# EAGLE schematic trill-bar (EAGLE 6.5.0)
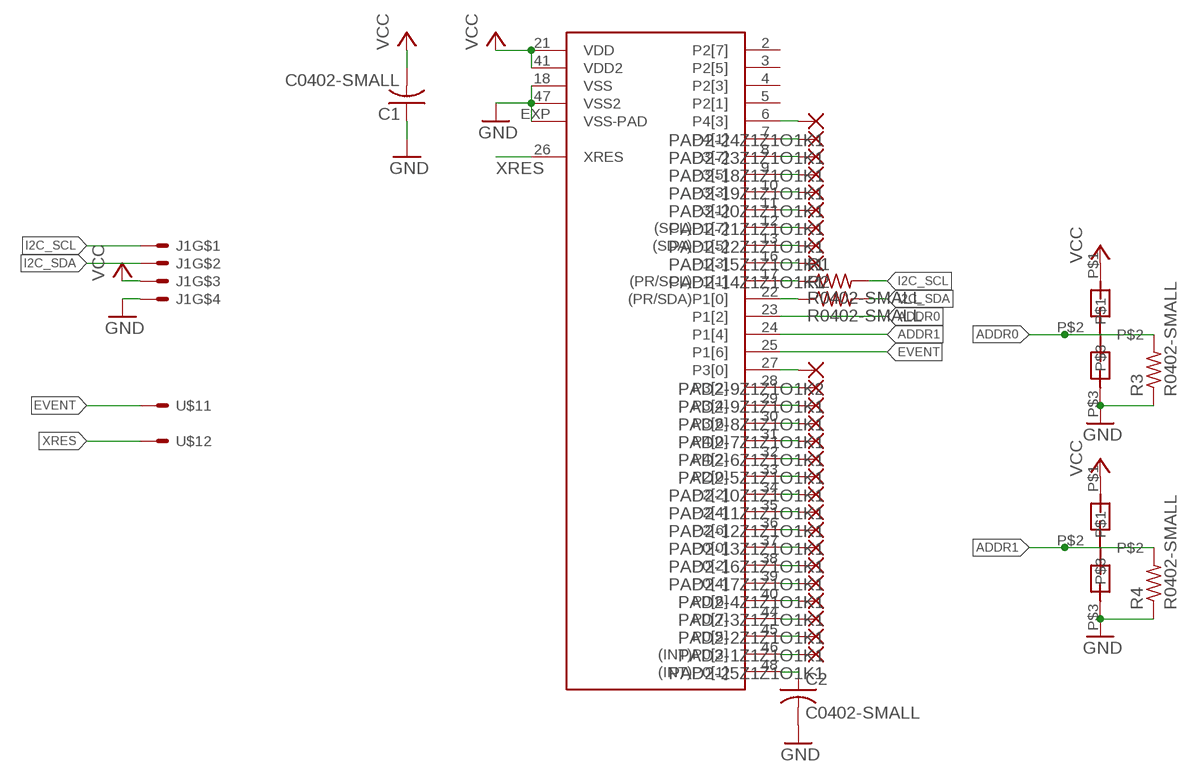
[diagram p0: schematic, sheet 1]

## Parts
C1  C0402-SMALL  [C0402-SMALL]
C2  C0402-SMALL  [C0402-SMALL]
IC1  CY8C206X6A  [QFN48-LEADS]
J1  GROVE-SMT  [JST-PH-4-SMT]
PAD2-1Z1Z1O1K1  SMD2  [SMD1,27-2,54]
PAD2-2Z1Z1O1K1  SMD2  [SMD1,27-2,54]
PAD2-3Z1Z1O1K1  SMD2  [SMD1,27-2,54]
PAD2-4Z1Z1O1K1  SMD2  [SMD1,27-2,54]
PAD2-5Z1Z1O1K1  SMD2  [SMD1,27-2,54]
PAD2-6Z1Z1O1K1  SMD2  [SMD1,27-2,54]
PAD2-7Z1Z1O1K1  SMD2  [SMD1,27-2,54]
PAD2-8Z1Z1O1K1  SMD2  [SMD1,27-2,54]
PAD2-9Z1Z1O1K1  SMD2  [SMD1,27-2,54]
PAD2-9Z1Z1O1K2  SMD2  [SMD1,27-2,54]
PAD2-10Z1Z1O1K1  SMD2  [SMD1,27-2,54]
PAD2-11Z1Z1O1K1  SMD2  [SMD1,27-2,54]
PAD2-12Z1Z1O1K1  SMD2  [SMD1,27-2,54]
PAD2-13Z1Z1O1K1  SMD2  [SMD1,27-2,54]
PAD2-14Z1Z1O1K1  SMD2  [SMD1,27-2,54]
PAD2-15Z1Z1O1K1  SMD2  [SMD1,27-2,54]
PAD2-16Z1Z1O1K1  SMD2  [SMD1,27-2,54]
PAD2-17Z1Z1O1K1  SMD2  [SMD1,27-2,54]
PAD2-18Z1Z1O1K1  SMD2  [SMD1,27-2,54]
PAD2-19Z1Z1O1K1  SMD2  [SMD1,27-2,54]
PAD2-20Z1Z1O1K1  SMD2  [SMD1,27-2,54]
PAD2-21Z1Z1O1K1  SMD2  [SMD1,27-2,54]
PAD2-22Z1Z1O1K1  SMD2  [SMD1,27-2,54]
PAD2-23Z1Z1O1K1  SMD2  [SMD1,27-2,54]
PAD2-24Z1Z1O1K1  SMD2  [SMD1,27-2,54]
PAD2-25Z1Z1O1K1  SMD2  [SMD1,27-2,54]
R1  R0402-SMALL  [C0402-SMALL]
R2  R0402-SMALL  [C0402-SMALL]
R3  R0402-SMALL  [C0402-SMALL]
R4  R0402-SMALL  [C0402-SMALL]
U$7  SOLDER_JUMPER_3PAD  [SOLDER_JUMPER_3PAD]
U$8  SOLDER_JUMPER_3PAD  [SOLDER_JUMPER_3PAD]
U$11  JST-SMT-EXTRAPAD  [JST-SMT-EXTRAPAD]
U$12  JST-SMT-EXTRAPAD  [JST-SMT-EXTRAPAD]

## Nets
ADDR0: IC1.23(P1[2]) R3.P$2 U$7.P$2
ADDR1: IC1.24(P1[4]) R4.P$2 U$8.P$2
EVENT: IC1.25(P1[6]) U$11.P$1(S)
GND: C1.P$1 C2.P$2 IC1.18(VSS) IC1.47(VSS2) IC1.EXP(VSS-PAD) J1.4 R3.P$1 R4.P$1 U$7.P$3 U$8.P$3
I2C_SCL: J1.1 R1.P$2
I2C_SDA: J1.2 R2.P$2
N$3: C2.P$1 IC1.48((INT)P0[1])
N$71Z1Z1O1K1: IC1.17((PR/SCL)P1[1]) R1.P$1
N$72Z1Z1O1K1: IC1.22((PR/SDA)P1[0]) R2.P$1
SENS1: IC1.27(P3[0]) PAD2-9Z1Z1O1K2.1(P)
SENS2: IC1.28(P3[2]) PAD2-9Z1Z1O1K1.1(P)
SENS3: IC1.29(P3[4]) PAD2-8Z1Z1O1K1.1(P)
SENS4: IC1.30(P3[6]) PAD2-7Z1Z1O1K1.1(P)
SENS5: IC1.31(P4[0]) PAD2-6Z1Z1O1K1.1(P)
SENS6: IC1.32(P4[2]) PAD2-5Z1Z1O1K1.1(P)
SENS7: IC1.33(P2[0]) PAD2-10Z1Z1O1K1.1(P)
SENS8: IC1.34(P2[2]) PAD2-11Z1Z1O1K1.1(P)
SENS9: IC1.35(P2[4]) PAD2-12Z1Z1O1K1.1(P)
SENS10: IC1.36(P2[6]) PAD2-13Z1Z1O1K1.1(P)
SENS11: IC1.16(P1[3]) PAD2-14Z1Z1O1K1.1(P)
SENS12: IC1.13((SDA)P1[5]) PAD2-15Z1Z1O1K1.1(P)
SENS13: IC1.37(P0[0]) PAD2-16Z1Z1O1K1.1(P)
SENS14: IC1.38(P0[2]) PAD2-17Z1Z1O1K1.1(P)
SENS15: IC1.39(P0[4]) PAD2-4Z1Z1O1K1.1(P)
SENS16: IC1.40(P0[6]) PAD2-3Z1Z1O1K1.1(P)
SENS17: IC1.44(P0[7]) PAD2-2Z1Z1O1K1.1(P)
SENS18: IC1.45(P0[5]) PAD2-1Z1Z1O1K1.1(P)
SENS19: IC1.46((INT)P0[3]) PAD2-25Z1Z1O1K1.1(P)
SENS20: IC1.6(P4[3]) PAD2-24Z1Z1O1K1.1(P)
SENS21: IC1.7(P4[1]) PAD2-23Z1Z1O1K1.1(P)
SENS22: IC1.8(P3[7]) PAD2-18Z1Z1O1K1.1(P)
SENS23: IC1.9(P3[5]) PAD2-19Z1Z1O1K1.1(P)
SENS24: IC1.10(P3[3]) PAD2-20Z1Z1O1K1.1(P)
SENS25: IC1.11(P3[1]) PAD2-21Z1Z1O1K1.1(P)
SENS26: IC1.12((SCL)P1[7]) PAD2-22Z1Z1O1K1.1(P)
VCC: C1.P$2 IC1.21(VDD) IC1.41(VDD2) J1.3 U$7.P$1 U$8.P$1
XRES: IC1.26(XRES) U$12.P$1(S)
Unconnected: IC1.2(P2[7]) IC1.3(P2[5]) IC1.4(P2[3]) IC1.5(P2[1])

## Library data of the parts
C1 C2 = custom:C0402-SMALL
IC1 = custom:CY8C206X6A
J1 = custom:GROVE-SMT
PAD2-1Z1Z1O1K1 PAD2-2Z1Z1O1K1 PAD2-3Z1Z1O1K1 PAD2-4Z1Z1O1K1 PAD2-5Z1Z1O1K1 PAD2-6Z1Z1O1K1 PAD2-7Z1Z1O1K1 PAD2-8Z1Z1O1K1 PAD2-9Z1Z1O1K1 PAD2-9Z1Z1O1K2 PAD2-10Z1Z1O1K1 PAD2-11Z1Z1O1K1 PAD2-12Z1Z1O1K1 PAD2-13Z1Z1O1K1 PAD2-14Z1Z1O1K1 PAD2-15Z1Z1O1K1 PAD2-16Z1Z1O1K1 PAD2-17Z1Z1O1K1 PAD2-18Z1Z1O1K1 PAD2-19Z1Z1O1K1 PAD2-20Z1Z1O1K1 PAD2-21Z1Z1O1K1 PAD2-22Z1Z1O1K1 PAD2-23Z1Z1O1K1 PAD2-24Z1Z1O1K1 PAD2-25Z1Z1O1K1 = custom:SMD2: SMD PAD
R1-R4 = custom:R0402-SMALL
U$7 U$8 = custom:SOLDER_JUMPER_3PAD
U$11 U$12 = custom:JST-SMT-EXTRAPAD